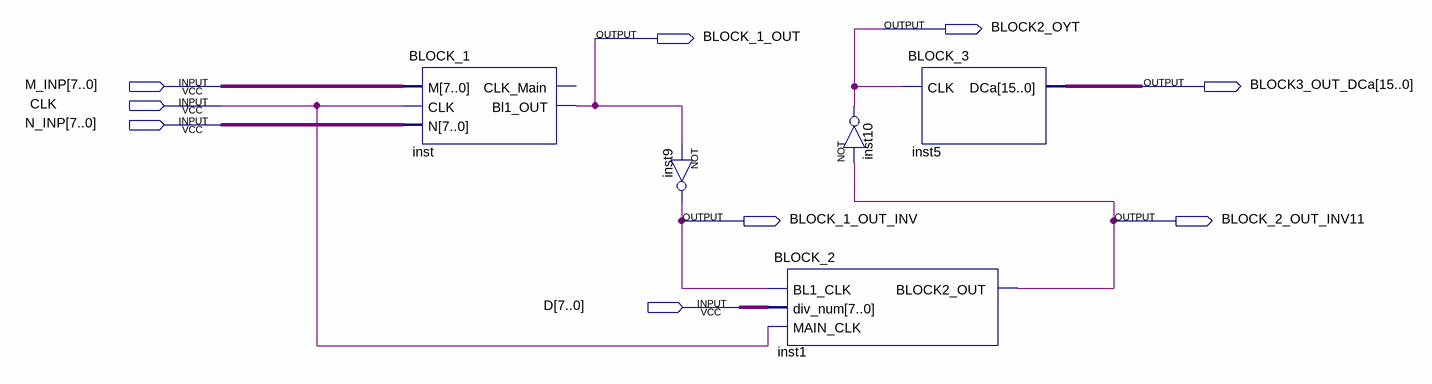
[diagram p0: schematic sheet]
// Quartus schematic MAIN.bdf as structural Verilog: 5 symbols, 9 pins
module MAIN (
  input  [7:0] M_INP,
  input  CLK,
  input  [7:0] N_INP,
  input  [7:0] D,
  output BLOCK2_OYT,
  output BLOCK_1_OUT,
  output [15:0] BLOCK3_OUT_DCa,
  output BLOCK_1_OUT_INV,
  output BLOCK_2_OUT_INV11
);

  BLOCK_1 inst (.M(M_INP), .CLK(CLK), .N(N_INP), .Bl1_OUT(BLOCK_1_OUT));  // open: CLK_Main
  not inst9 (BLOCK_1_OUT_INV, BLOCK_1_OUT);
  not inst10 (BLOCK2_OYT, BLOCK_2_OUT_INV11);
  BLOCK_2 inst1 (.BL1_CLK(BLOCK_1_OUT_INV), .div_num(D), .MAIN_CLK(CLK), .BLOCK2_OUT(BLOCK_2_OUT_INV11));
  BLOCK_3 inst5 (.CLK(BLOCK2_OYT), .DCa(BLOCK3_OUT_DCa));
endmodule
